# Altium project PCB_Project1.PrjPCB
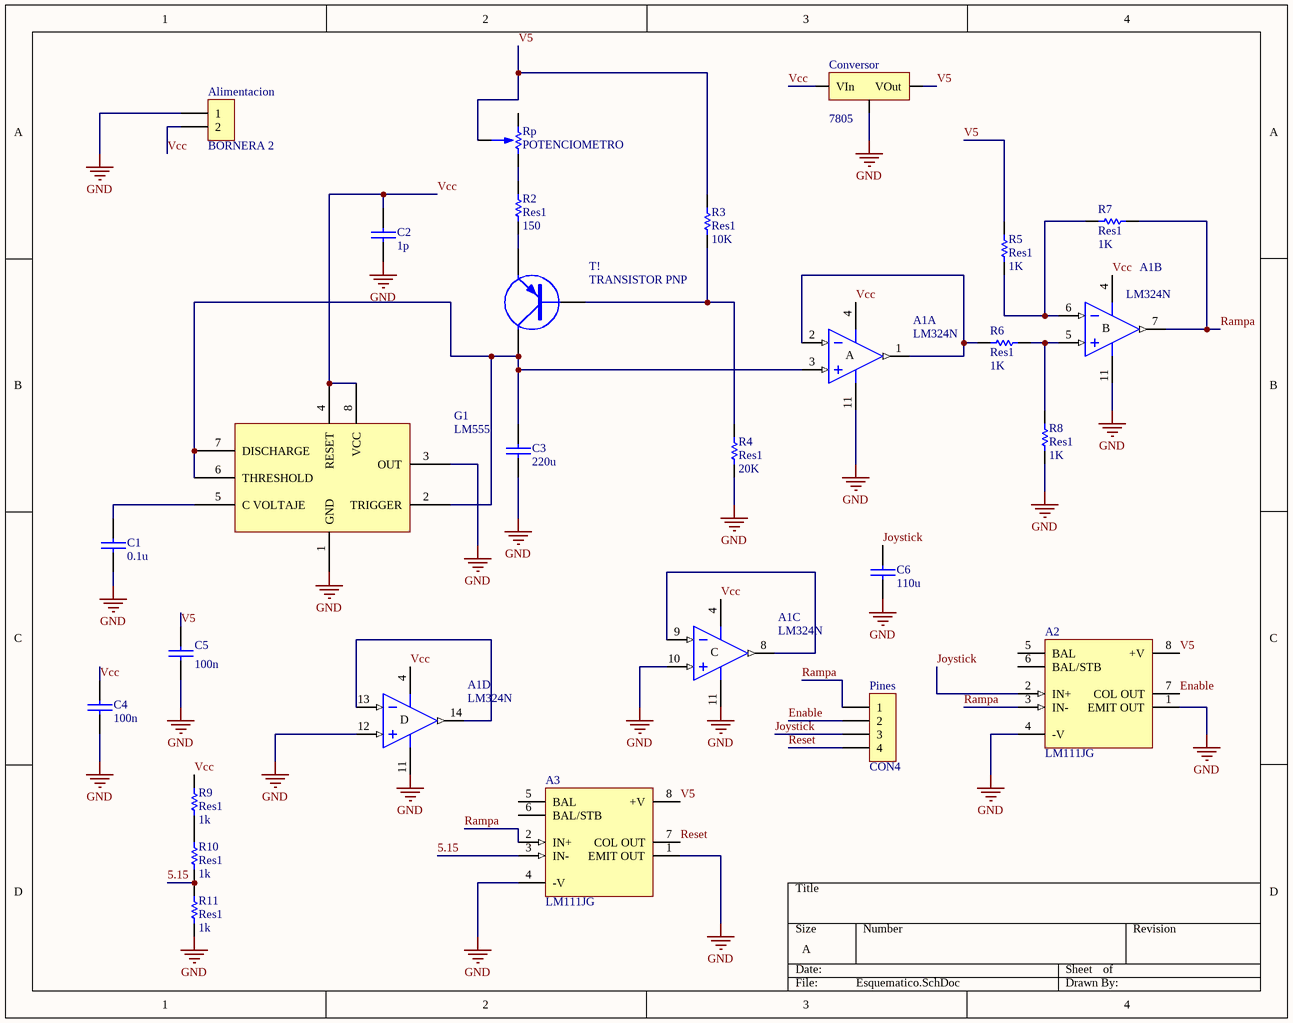
[diagram p0: Esquematico.SchDoc]
1 sheet, 25 parts. Net scope: global (net labels, ports and power ports of the same name join across sheets).
Board file: PCB.PcbDoc

## Sheet Esquematico.SchDoc
size A

### Parts
A1  LM324N  [N014]  (parts A,B,C,D of 4)
A2  LM111JG  [JG008]
A3  LM111JG  [JG008]
Alimentacion  BORNERA 2  [BORNERA2]
C1  0.1u  [CAP100]
C2  1p  [CAP100]
C3  220u  [CAP100]
C4  100n  [CAP100]
C5  100n  [CAP100]
C6  110u  [CAP100]
Conversor  7805  [TO-220 V]
G1  LM555  [DIP8]
Pines  CON4  [SIP4]
R2  Res1  value 150  [AXIAL-0.3]
R3  Res1  value 10K  [AXIAL-0.3]
R4  Res1  value 20K  [AXIAL-0.3]
R5  Res1  value 1K  [AXIAL-0.3]
R6  Res1  value 1K  [AXIAL-0.3]
R7  Res1  value 1K  [AXIAL-0.3]
R8  Res1  value 1K  [AXIAL-0.3]
R9  Res1  value 1k  [AXIAL-0.3]
R10  Res1  value 1k  [AXIAL-0.3]
R11  Res1  value 1k  [AXIAL-0.3]
Rp  POTENCIOMETRO  [POTENCIOMETRO]
T!  TRANSISTOR PNP  [TO92]

### Nets
GND: A1.10(IN+) A1.11(V-) A1.12(IN+) A2.1(EMIT_OUT) A2.4(-V) A3.1(EMIT_OUT) A3.4(-V) Alimentacion.1 C1.2 C2.2 C3.2 C4.2 C5.2 C6.2 Conversor.2(GND) G1.1(GND) G1.3(OUT) R4.1 R8.1 R11.1
5.15: A3.3(IN-) R10.1 R11.2
Enable: A2.7(COL_OUT) Pines.2
Joystick: A2.2(IN+) C6.1 Pines.3
Rampa: A1.7(OUT) A2.3(IN-) A3.2(IN+) Pines.1 R7.1
Reset: A3.7(COL_OUT) Pines.4
V5: A2.8(+V) A3.8(+V) C5.1 Conversor.3(VOut) R3.2 R5.2 Rp.2
Vcc: A1.4(V+) Alimentacion.2 C2.1 C4.1 Conversor.1(VIn) G1.4(RESET) G1.8(VCC) R9.2
NetA1_1: A1.1(OUT) A1.2(IN-) R6.2
NetA1_3: A1.3(IN+) C3.1 G1.2(TRIGGER) G1.6(THRESHOLD) G1.7(DISCHARGE) T!.2(C)
NetA1_5: A1.5(IN+) R6.1 R8.2
NetA1_6: A1.6(IN-) R5.1 R7.2
NetA1_8: A1.8(OUT) A1.9(IN-)
NetA1_13: A1.13(IN-) A1.14(OUT)
NetC1_1: C1.1 G1.5(C_VOLTAJE)
NetR2_1: R2.1 T!.3(E)
NetR2_2: R2.2 Rp.1
NetR3_1: R3.1 R4.2 T!.1(B)
NetR9_1: R9.1 R10.2

Not connected (* = marked no-connect by the designer): A2 5(BAL) 6(BAL/STB); A3 5(BAL) 6(BAL/STB); Rp 3

### Notes on the sheet
- (in symbol LM324N, part A) A
- (in symbol LM324N, part B) B
- (in symbol LM324N, part C) C
- (in symbol LM324N, part D) D

### Library data of the parts
A1 = LM324N: Quadruple Operational Amplifier; Published: 16-Jan-2001; LatestRevisionDate: 04-Mar-2005; LatestRevisionNote: Stylized 3D Model Added.; DatasheetVersion: Feb-1997; PackageVersion: Oct-1995; PackageReference: N014; Publisher: Altium Limited; PackageDescription: DIP; 14 Leads; Row Spacing 7.62 mm; Pitch 2.54 mm; ComponentLink1Description: Manufacturer Link; ComponentLink1URL: http://www.ti.com/; ComponentLink2Description: Datasheet; ComponentLink2URL: http://www-s.ti.com/sc/ds/lm324.pdf
A2 A3 = LM111JG: Differential Comparator with Strobe; Published: 16-Jan-2001; LatestRevisionDate: 04-Mar-2005; LatestRevisionNote: Stylized 3D Model Added.; DatasheetVersion: Feb-1992; PackageVersion: Jan-1995; PackageReference: JG008; Publisher: Altium Limited; PackageDescription: DIP; 8 Leads; Row Spacing 7.62 mm; Pitch 2.54 mm; ComponentLink1Description: Manufacturer Link; ComponentLink1URL: http://www.ti.com/; ComponentLink2Description: Datasheet; ComponentLink2URL: http://www-s.ti.com/sc/ds/lm111.pdf
C1-C6 = CAP
Conversor = 78XX: REGULDOR POSITIVO
G1 = LM555: Timer
R2-R11 = Res1: Resistor; Published: 8-Jun-2000; LatestRevisionDate: 17-Jul-2002; LatestRevisionNote: Re-released for DXP Platform.; PackageReference: AXIAL-0.3; Publisher: Altium Limited; PackageDescription: Axial Device, Thru-Hole; 2 Leads; 0.3 in Pin Spacing